# Altium schematic sheet FUC.SchDoc
size A4; SheetNumber: 1; SheetTotal: 1
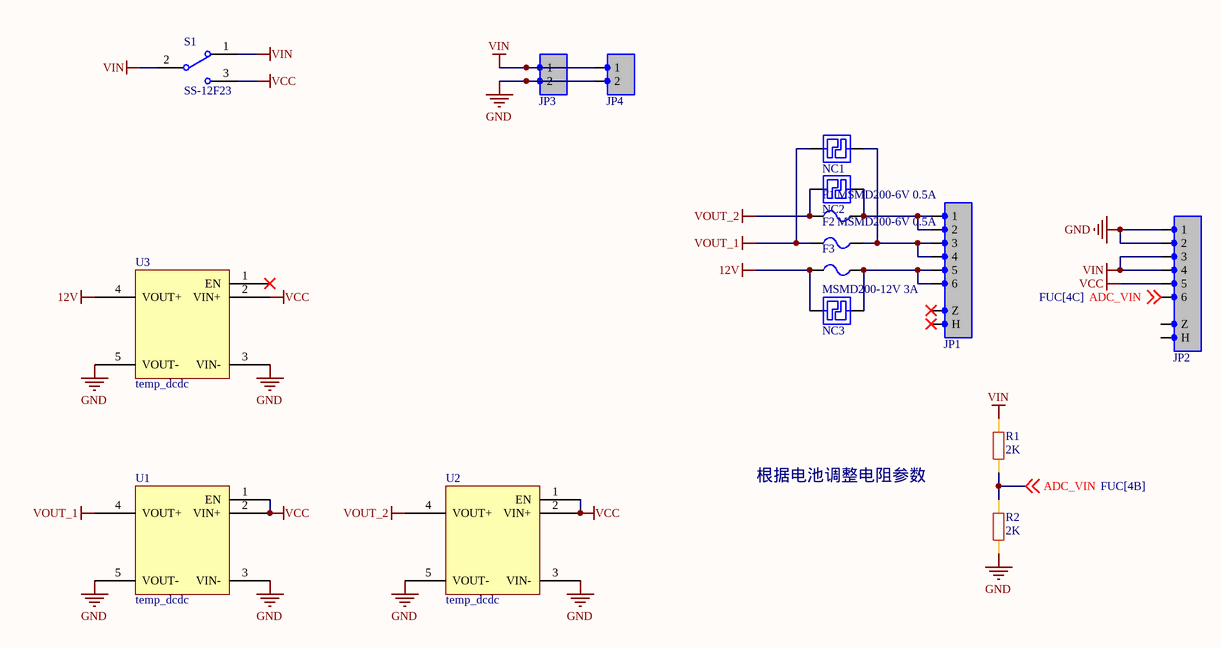
[diagram p0: FUC.SchDoc]

## Parts
F1  MSMD200-6V 0.5A  [FU 0805]
F2  MSMD200-6V 0.5A  [FU 0805]
F3  MSMD200-12V 3A  [FU 0805]
JP1  HDR-1X6  [HDR2.54-LI-6P]  (value not drawn)
JP2  HDR-1X6  [HDR2.54-LI-6P]  (value not drawn)
JP3  HDR-1X2  [XH2.54-WI-2P]  (value not drawn)
JP4  HDR-1X2  [HDR2.54-LI-2P]  (value not drawn)
NC1  Node  [NODE-2]  (value not drawn)
NC2  Node  [NODE-2]  (value not drawn)
NC3  Node  [NODE-2]  (value not drawn)
R1  2K  [R 0603_L]
R2  2K  [R 0603_L]
S1  SS-12F23  [SS-12D10]
U1  temp_dcdc  [TEMP_DCDC]
U2  temp_dcdc  [TEMP_DCDC]
U3  temp_dcdc  [TEMP_12V]

## Nets
12V: F3.2 NC3.1 U3.4(VOUT+)
GND: JP2.1 JP2.2 JP3.2 JP4.2 R2.2 U1.3(VIN-) U1.5(VOUT-) U2.3(VIN-) U2.5(VOUT-) U3.3(VIN-) U3.5(VOUT-)
VCC: JP2.5 S1.3 U1.1(EN) U1.2(VIN+) U2.1(EN) U2.2(VIN+) U3.2(VIN+)
VIN: JP2.3 JP2.4 JP3.1 JP4.1 R1.1 S1.1 S1.2
VOUT_1: F2.1 NC1.1 U1.4(VOUT+)
VOUT_2: F1.1 NC2.1 U2.4(VOUT+)
ADC_VIN: JP2.6 R1.2 R2.1 ; off-sheet ADC_VIN
NetF1_2: F1.2 JP1.1 JP1.2 NC2.2
NetF2_2: F2.2 JP1.3 JP1.4 NC1.2
NetF3_1: F3.1 JP1.5 JP1.6 NC3.2

Not connected (* = marked no-connect by the designer): JP1 0(Z)* 100(H)*; JP2 0(Z) 100(H); U3 1(EN)*

## Notes on the sheet
- 根据电池调整电阻参数

## Library data of the parts
F1-F3 = FU: 贴片保险丝; 版权归属: 源创客; BOM名称: 贴片保险丝; 学习资源: www.ooocke.com
JP1 JP2 = Header 6: 6P接插件; 版权归属: 源创客; BOM名称: 6P接插件; 学习资源: www.ooocke.com
JP3 JP4 = Header 2: 2P接插件; 版权归属: 源创客; BOM名称: 2P接插件; 学习资源: www.ooocke.com
NC1-NC3 = NODE: 大电流节点
R1 R2 = 电阻: 贴片电阻1%精度
S1 = SSW-1P: 1路拨动开关; BOM名称: 波动开关; 版权归属: 源创客; 学习资源: www.ooocke.com
U1-U3 = temp_dcdc: 升降压模块